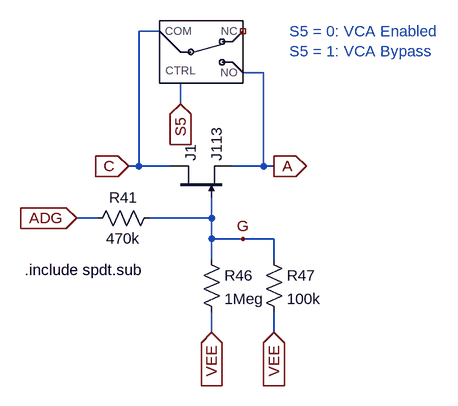
[diagram p0: schematic VCA.asc]
VCA.asc, the LTspice schematic file:
Version 4.1
SHEET 1 1048 680
WIRE -80 -176 -112 -176
WIRE 80 -112 48 -112
WIRE -48 -64 -48 -96
WIRE -112 32 -112 -176
WIRE -112 32 -128 32
WIRE -64 32 -112 32
WIRE 80 32 80 -112
WIRE 80 32 32 32
WIRE 96 32 80 32
WIRE -176 112 -208 112
WIRE 0 112 0 80
WIRE 0 112 -96 112
WIRE 0 144 0 112
WIRE 48 144 0 144
WIRE 96 144 48 144
WIRE 0 176 0 144
WIRE 96 176 96 144
WIRE 0 288 0 256
WIRE 96 288 96 256
FLAG 0 288 VEE
IOPIN 0 288 In
FLAG 96 288 VEE
IOPIN 96 288 In
FLAG -208 112 ADG
IOPIN -208 112 In
FLAG -128 32 C
IOPIN -128 32 In
FLAG 96 32 A
IOPIN 96 32 Out
FLAG -48 -64 S5
IOPIN -48 -64 In
FLAG 48 144 G
SYMBOL njf -64 80 R270
SYMATTR InstName J1
SYMATTR Value J113
SYMBOL res -16 160 R0
SYMATTR InstName R46
SYMATTR Value 1Meg
SYMBOL res 80 160 R0
SYMATTR InstName R47
SYMATTR Value 100k
SYMBOL res -80 96 R90
WINDOW 0 0 56 VBottom 2
WINDOW 3 32 56 VTop 2
SYMATTR InstName R41
SYMATTR Value 470k
SYMBOL spdt -48 -144 M0
WINDOW 3 0 0 Invisible 0
WINDOW 0 0 28 Invisible 0
SYMATTR InstName S5
TEXT -288 192 Left 2 !.include spdt.sub
TEXT 120 -176 Left 2 ;S5 = 0: VCA Enabled\nS5 = 1: VCA Bypass

The netlist it stands for:
* VCA.asc
J1 C G A J113
R46 G VEE 1Meg
R47 G VEE 100k
R41 G ADG 470k
X§S5 C A NC_01 S5 SPDT  ; pins COM NO NC CTRL
.model NJF NJF
.model PJF PJF
.lib standard.jft
.include spdt.sub
* S5 = 0: VCA Enabled
* S5 = 1: VCA Bypass
.backanno
.end